# EAGLE design PiPod Rev2 (EAGLE 8.5.0)

## Sheet 1 of 4
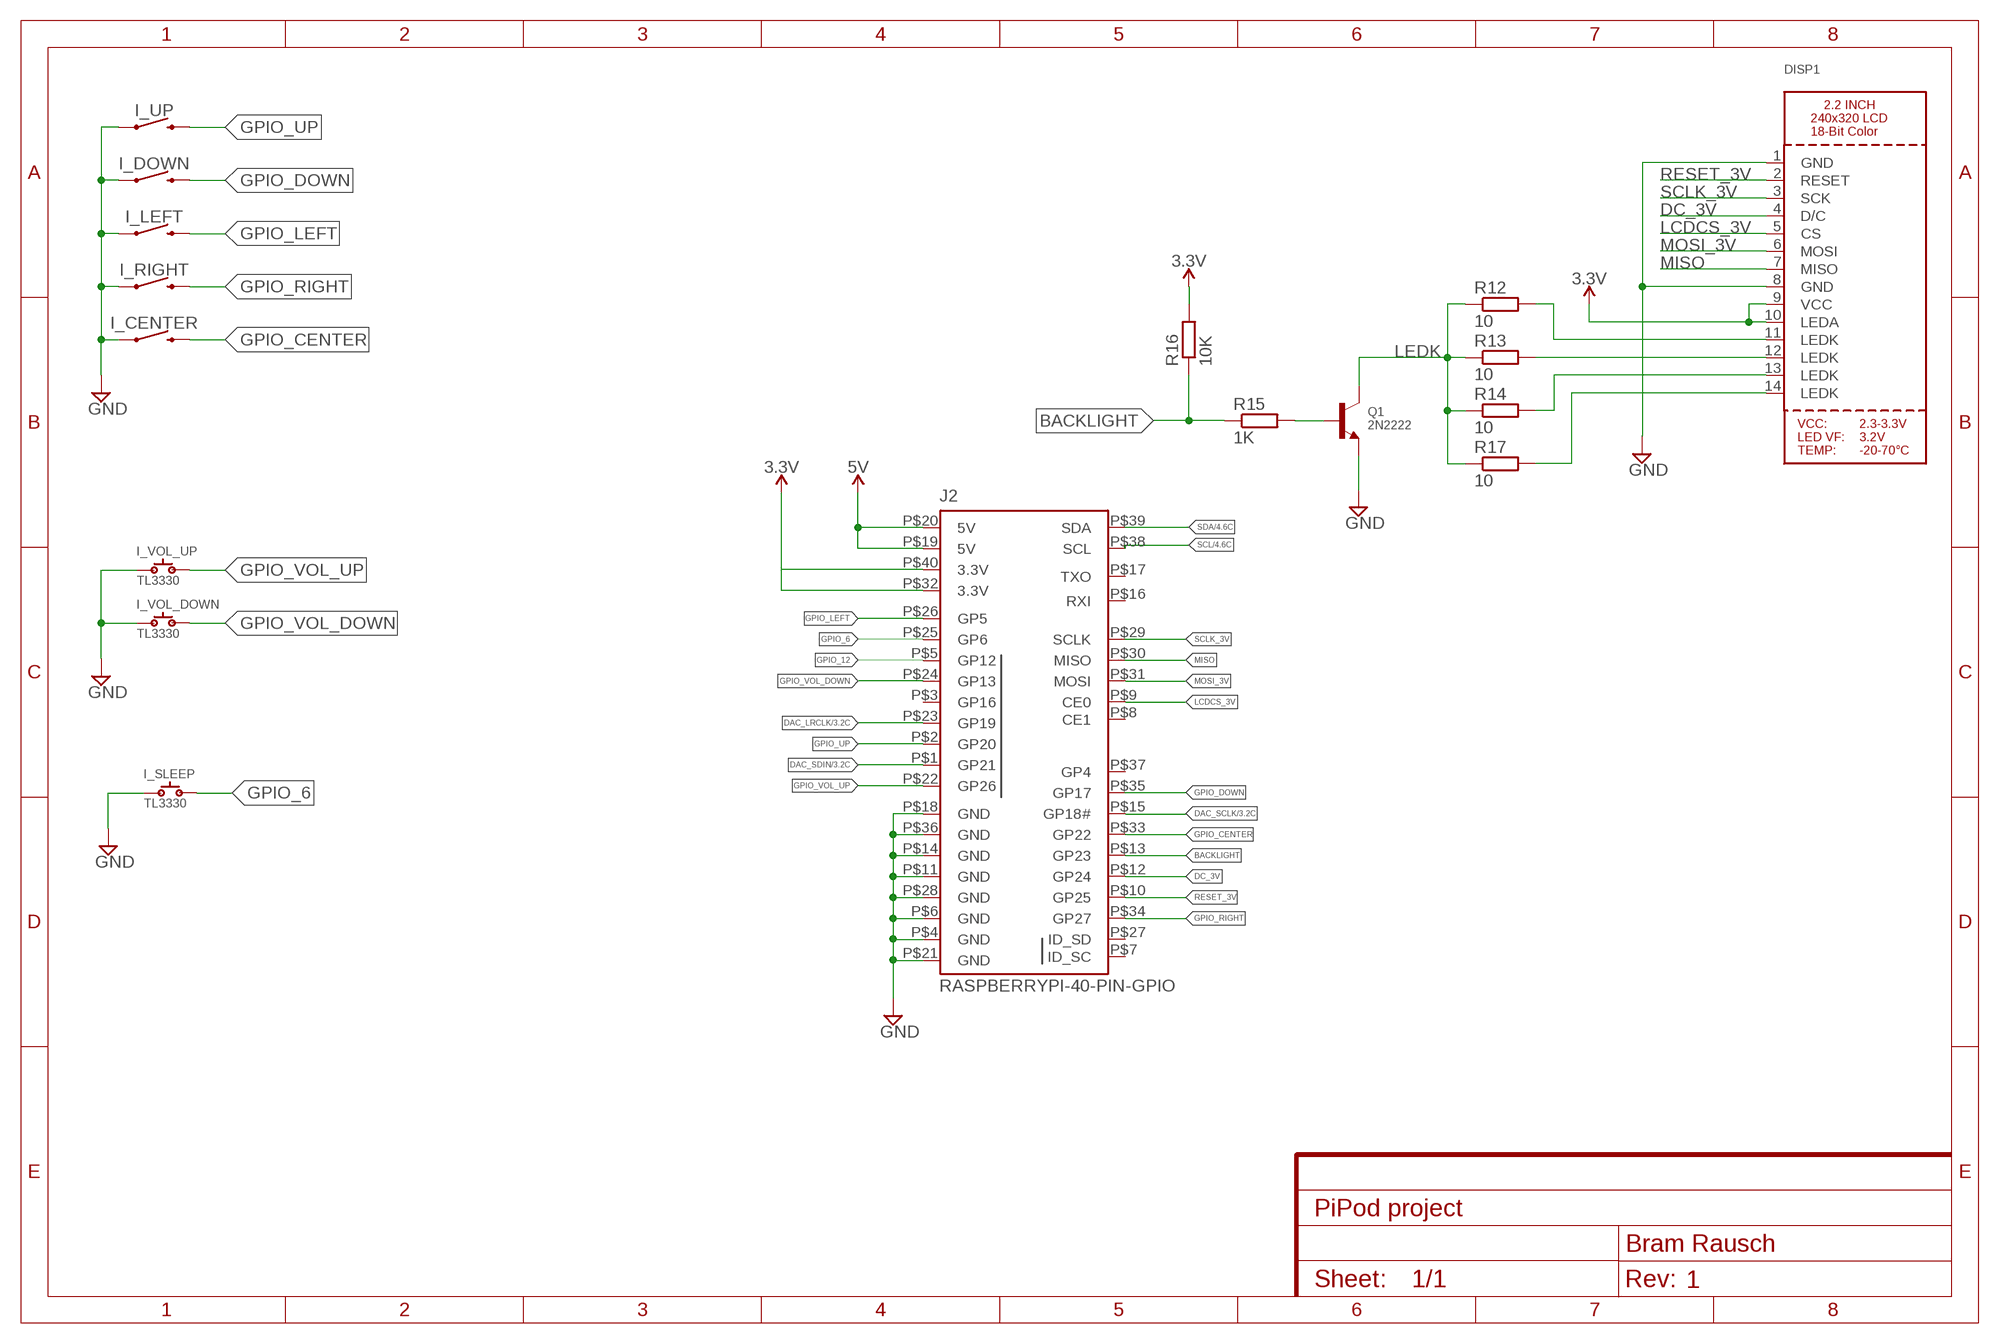
[diagram p0: schematic, sheet 1]
FRAME3 (FRAME-A4L): TITLE: PiPod - In/Out

### Parts
DISP1  DISP_LCD_TM022HDH26  [TM022HDH26_2.2IN_LCD]
I_CENTER  MOMENTARY-SWITCH-SPST-SMD-5.2-REDUNDANT  [TACTILE_SWITCH_SMD_5.2MM]
I_DOWN  MOMENTARY-SWITCH-SPST-SMD-5.2-REDUNDANT  [TACTILE_SWITCH_SMD_5.2MM]
I_LEFT  MOMENTARY-SWITCH-SPST-SMD-5.2-REDUNDANT  [TACTILE_SWITCH_SMD_5.2MM]
I_RIGHT  MOMENTARY-SWITCH-SPST-SMD-5.2-REDUNDANT  [TACTILE_SWITCH_SMD_5.2MM]
I_SLEEP  TL3330  [TL3330]
I_UP  MOMENTARY-SWITCH-SPST-SMD-5.2-REDUNDANT  [TACTILE_SWITCH_SMD_5.2MM]
I_VOL_DOWN  TL3330  [TL3330]
I_VOL_UP  TL3330  [TL3330]
J2  RASPBERRYPI-40-PIN-GPIO  [2X20_SMD]
Q1  2N2222  TRANSISTOR_NPNWIDE  [SOT23-WIDE]
R12  10  R-EU_R0805  [R0805]
R13  10  R-EU_R0805  [R0805]
R14  10  R-EU_R0805  [R0805]
R15  1K  R-EU_R0805  [R0805]
R16  10K  R-EU_R0805  [R0805]
R17  10  R-EU_R0805  [R0805]

### Nets
3.3V: DISP1.9(VCC) DISP1.10(LEDA) J2.P$32(3.3V) J2.P$40(3.3V) R16.2 ; also sheet 3
5V: J2.P$19(5V) J2.P$20(5V) ; also sheet 2
BACKLIGHT: J2.P$13(GP23) R15.1 R16.1
DAC_LRCLK: J2.P$23(GP19) ; also sheet 3
DAC_SCLK: J2.P$15(GP18#) ; also sheet 3
DAC_SDIN: J2.P$1(GP21) ; also sheet 3
DC_3V: DISP1.4(D/C) J2.P$12(GP24)
GND: DISP1.1(GND) DISP1.8(GND) I_CENTER.1 I_CENTER.2 I_DOWN.1 I_DOWN.2 I_LEFT.1 I_LEFT.2 I_RIGHT.1 I_RIGHT.2 I_SLEEP.1 I_UP.1 I_UP.2 I_VOL_DOWN.1 I_VOL_UP.1 J2.P$4(GND) J2.P$6(GND) J2.P$11(GND) J2.P$14(GND) J2.P$18(GND) J2.P$21(GND) J2.P$28(GND) J2.P$36(GND) Q1.2(E) ; also sheet 2,3,4
GPIO_6: I_SLEEP.2 J2.P$25(GP6)
GPIO_12: J2.P$5(GP12)
GPIO_CENTER: I_CENTER.3 I_CENTER.4 J2.P$33(GP22)
GPIO_DOWN: I_DOWN.3 I_DOWN.4 J2.P$35(GP17)
GPIO_LEFT: I_LEFT.3 I_LEFT.4 J2.P$26(GP5)
GPIO_RIGHT: I_RIGHT.3 I_RIGHT.4 J2.P$34(GP27)
GPIO_UP: I_UP.3 I_UP.4 J2.P$2(GP20)
GPIO_VOL_DOWN: I_VOL_DOWN.2 J2.P$24(GP13)
GPIO_VOL_UP: I_VOL_UP.2 J2.P$22(GP26)
LCDCS_3V: DISP1.5(CS) J2.P$9(CE0)
LEDK: Q1.3(C) R12.1 R13.1 R14.1 R17.1
MISO: DISP1.7(MISO) J2.P$30(MISO)
MOSI_3V: DISP1.6(MOSI) J2.P$31(MOSI)
N$21: DISP1.11(LEDK) R12.2
N$22: DISP1.12(LEDK) R13.2
N$23: DISP1.13(LEDK) R14.2
N$25: Q1.1(B) R15.2
N$26: DISP1.14(LEDK) R17.2
RESET_3V: DISP1.2(RESET) J2.P$10(GP25)
SCL: J2.P$38(SCL) ; also sheet 4
SCLK_3V: DISP1.3(SCK) J2.P$29(SCLK)
SDA: J2.P$39(SDA) ; also sheet 4
Unconnected: J2.P$3(GP16) J2.P$7(ID_SC) J2.P$8(CE1) J2.P$16(RXI) J2.P$17(TXO) J2.P$27(ID_SD) J2.P$37(GP4)

## Sheet 2 of 4
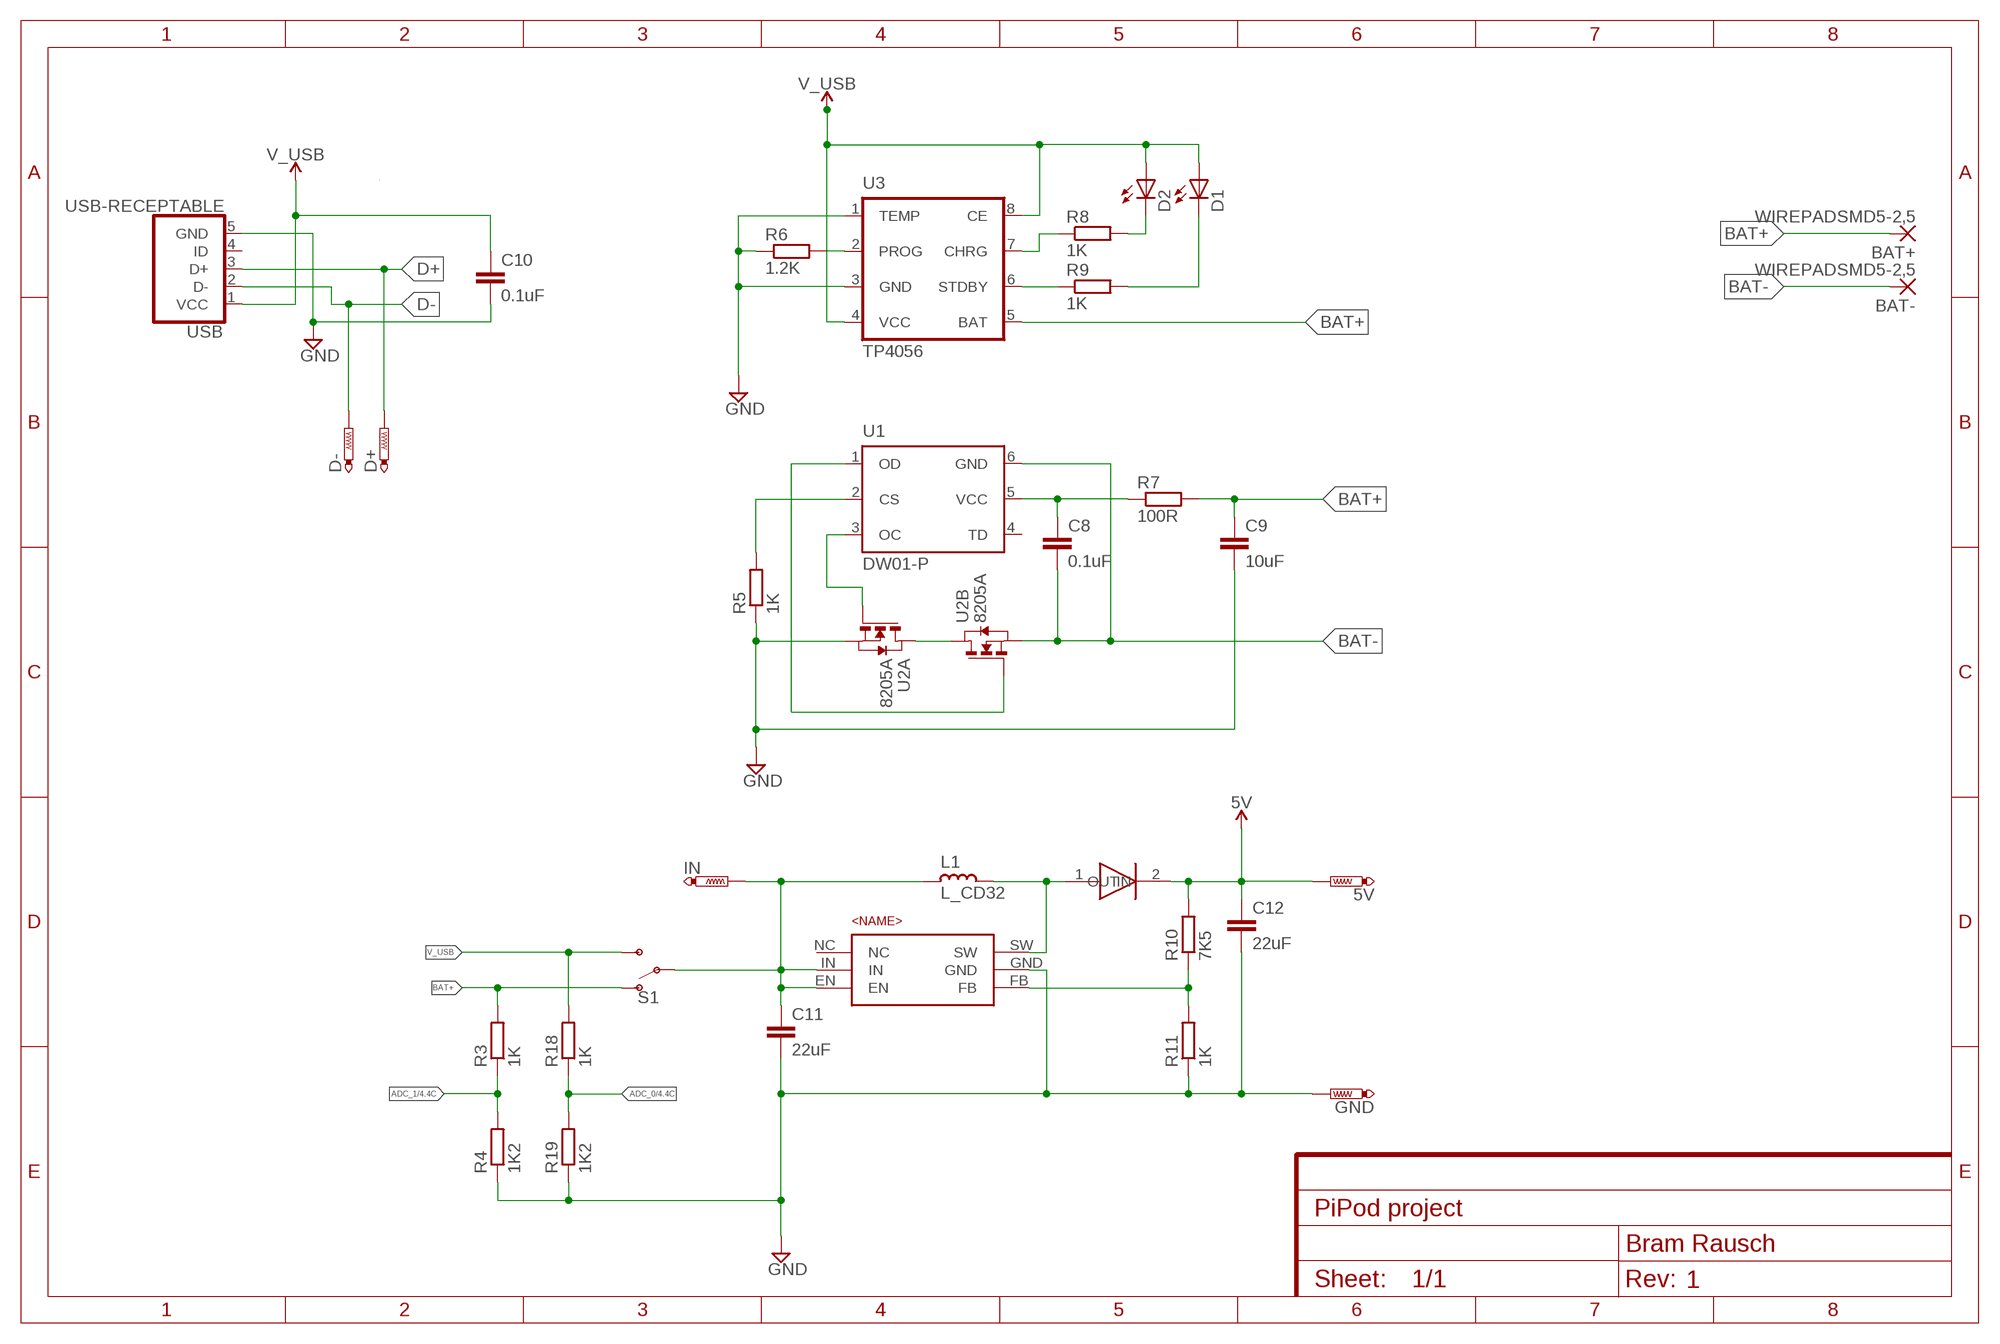
[diagram p1: schematic, sheet 2]
FRAME2 (FRAME-A4L): TITLE: PiPod - Power

### Parts
5V  PTR1B2,54  [B2,54]
BAT+  WIREPADSMD5-2,5  [5-2,5]
BAT-  WIREPADSMD5-2,5  [5-2,5]
C8  0.1uF  C-EUC1206K  [C1206K]
C9  10uF  C-EUC1206K  [C1206K]
C10  0.1uF  C-EUC1206K  [C1206K]
C11  22uF  C-EUC0805K  [C0805K]
C12  22uF  C-EUC0805K  [C0805K]
D1  LEDCHIPLED_0805  [CHIPLED_0805]
D2  LEDCHIPLED_0805  [CHIPLED_0805]
D+  PTR1TP15R  [TP15R]
D-  PTR1TP15R  [TP15R]
GND  PTR1B2,54  [B2,54]
IN  PTR1B2,54  [B2,54]
L1  L_CD32  [CD32]
R3  1K  R-EU_R0805  [R0805]
R4  1K2  R-EU_R0805  [R0805]
R5  1K  R-EU_M0805  [M0805]
R6  1.2K  R-EU_M0805  [M0805]
R7  100R  R-EU_M0805  [M0805]
R8  1K  R-EU_M0805  [M0805]
R9  1K  R-EU_M0805  [M0805]
R10  7K5  R-EU_R0805  [R0805]
R11  1K  R-EU_R0805  [R0805]
R18  1K  R-EU_R0805  [R0805]
R19  1K2  R-EU_R0805  [R0805]
S1  SWITCH-SPDT-PTH-11.6X4.0MM  [SWITCH_SPDT_PTH_11.6X4.0MM]
U1  DW01-P  [SOT23-6L]
U2  8205A  [TSSOP8]
U3  TP4056  [SO08]
U6  MT3608  [SOT23-6]
U$9  SMA-SS34  [SMA-SS34]
USB  USB-RECEPTABLE  [FCI-10103594-0001LF]

### Nets
5V: 5V.TP C12.1 R10.2 U$9.2(OUT) ; also sheet 1
ADC_0: R18.1 R19.2 ; also sheet 4
ADC_1: R3.1 R4.2 ; also sheet 4
BAT+: BAT+.1(P) C9.1 R3.2 R7.2 S1.1(O) U3.5(BAT)
BAT-: BAT-.1(P) C8.2 U1.6(GND) U2.6(B:S) U2.7(B:S)
D+: D+.TP USB.3(D+)
D-: D-.TP USB.2(D-)
GND: C9.2 C10.2 C11.2 C12.2 GND.TP R4.1 R5.1 R6.1 R11.1 R19.1 U2.2(A:S) U2.3(A:S) U3.1(TEMP) U3.3(GND) U6.GND USB.5(GND) ; also sheet 1,3,4
N$8: U2.1(A:D) U2.8(B:D)
N$11: U1.1(OD) U2.5(B:G)
N$12: R5.2 U1.2(CS)
N$13: R6.2 U3.2(PROG)
N$14: U1.3(OC) U2.4(A:G)
N$15: R9.1 U3.6(STDBY)
N$16: C8.1 R7.1 U1.5(VCC)
N$17: D2.C R8.2
N$18: D1.C R9.2
N$19: R8.1 U3.7(CHRG)
N$20: L1.1 U6.SW U$9.1(IN)
N$24: R10.1 R11.2 U6.FB
N$33: C11.1 IN.TP L1.2 S1.2(P) U6.EN U6.IN
V_USB: C10.1 D1.A D2.A R18.2 S1.3(S) U3.4(VCC) U3.8(CE) USB.1(VCC)
Unconnected: U1.4(TD) U6.NC USB.4(ID)

## Sheet 3 of 4
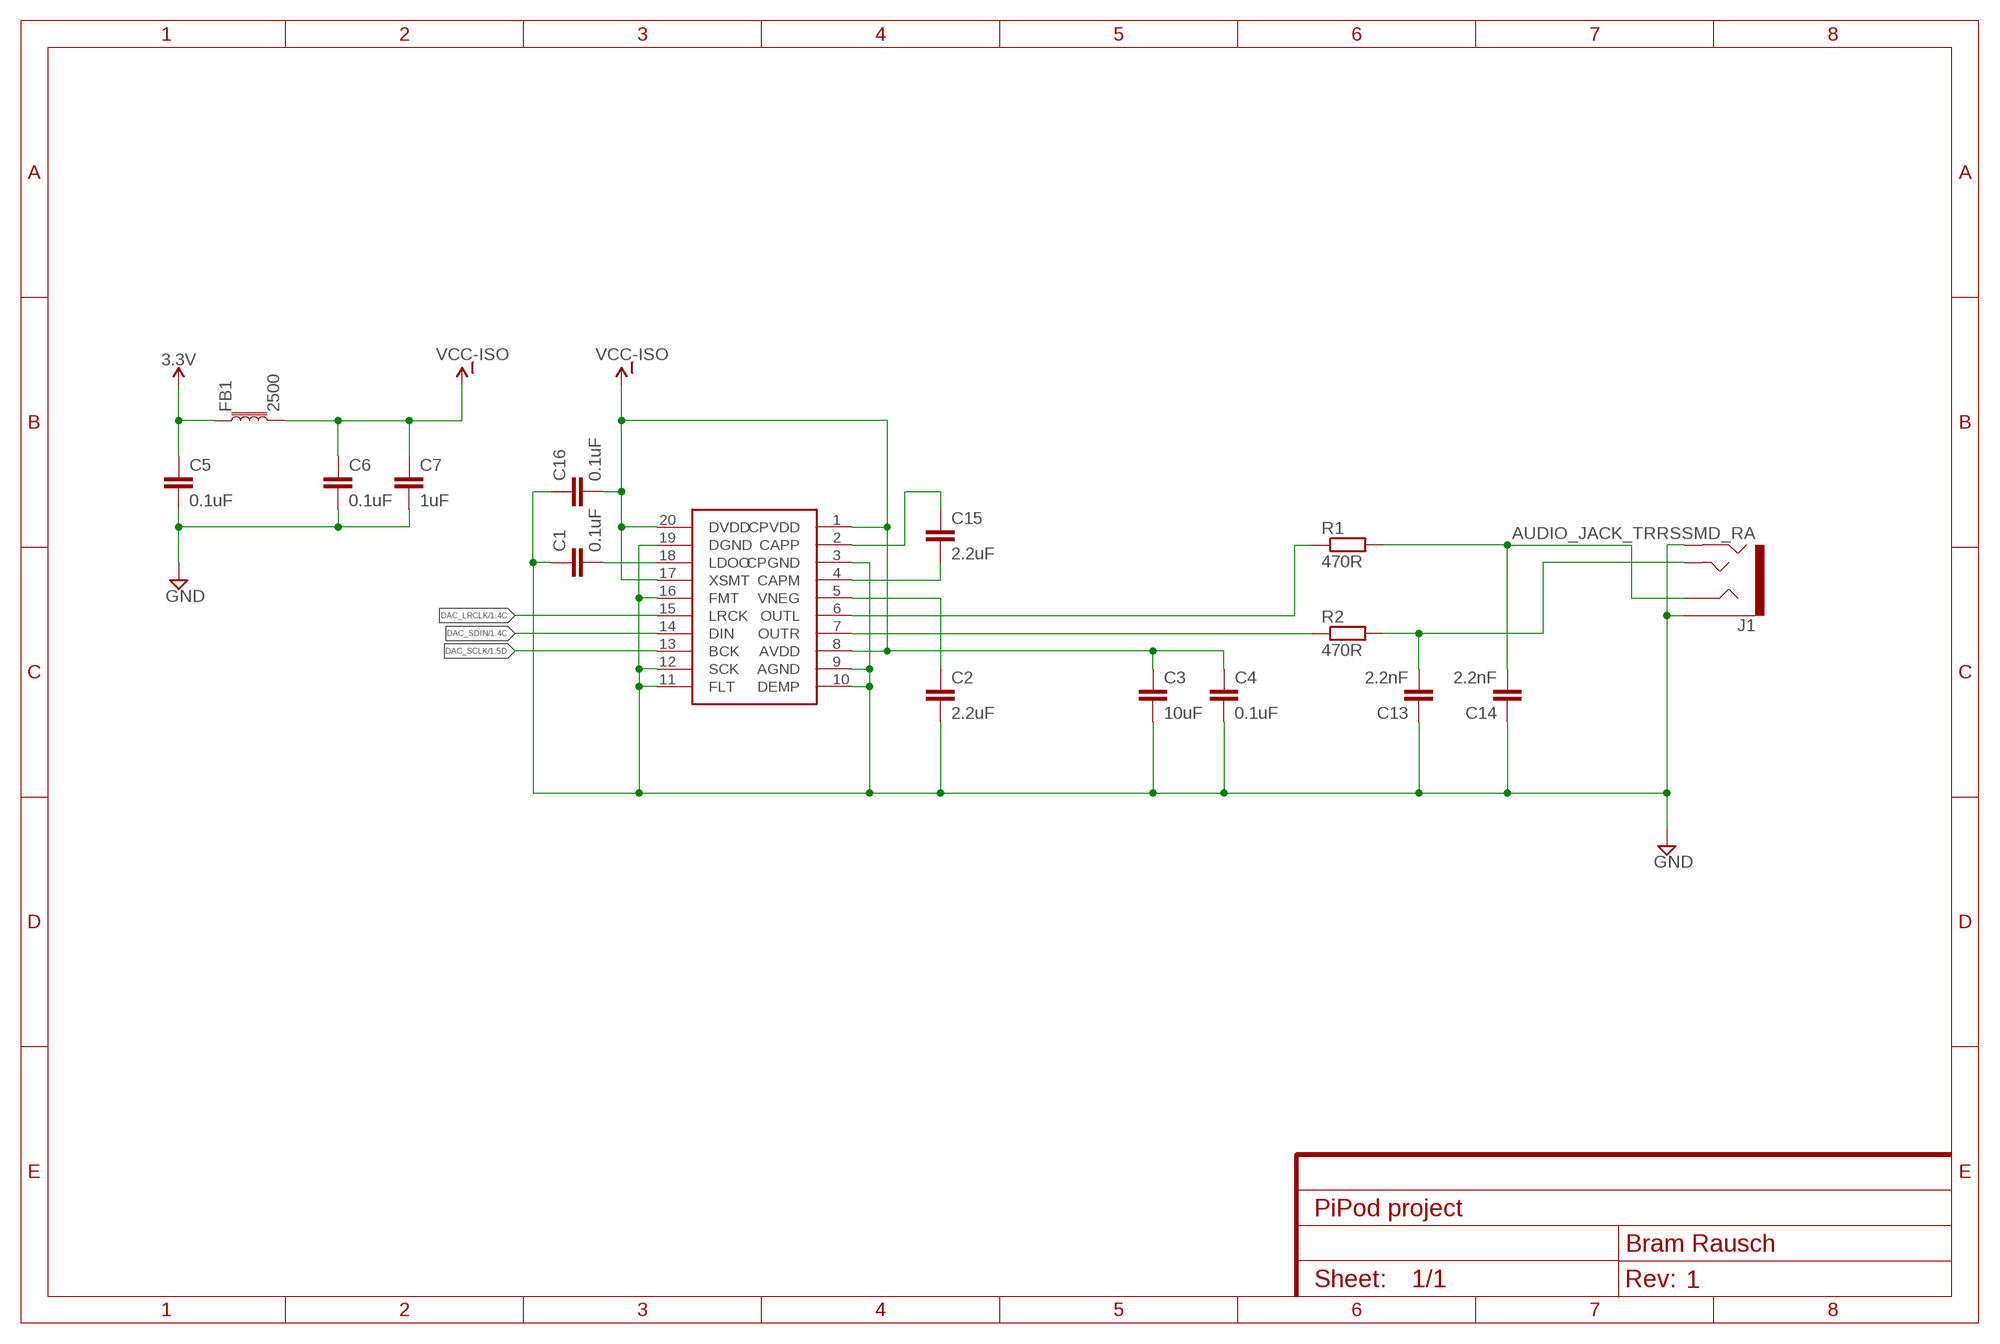
[diagram p2: schematic, sheet 3]
FRAME1 (FRAME-A4L): TITLE: PiPod - DAC

### Parts
C1  0.1uF  C-EUC0805K  [C0805K]
C2  2.2uF  C-EUC0805K  [C0805K]
C3  10uF  C-EUC0805K  [C0805K]
C4  0.1uF  C-EUC0805K  [C0805K]
C5  0.1uF  C-EUC0805K  [C0805K]
C6  0.1uF  C-EUC0805K  [C0805K]
C7  1uF  C-EUC0805K  [C0805K]
C13  2.2nF  C-EUC0805K  [C0805K]
C14  2.2nF  C-EUC0805K  [C0805K]
C15  2.2uF  C-EUC0805K  [C0805K]
C16  0.1uF  C-EUC0805K  [C0805K]
FB1  2500  FERRITE_BEAD-0603  [0603]
J1  AUDIO_JACK_TRRSSMD_RA  [AUDIO_JACK_3.5MM_TRRS_SMD_RA]
R1  470R  R-EU_R0805  [R0805]
R2  470R  R-EU_R0805  [R0805]
U5  PCM5102  [TSSOP20]

### Nets
3.3V: C5.1 FB1.1 ; also sheet 1
DAC_LRCLK: U5.15(LRCK) ; also sheet 1
DAC_SCLK: U5.13(BCK) ; also sheet 1
DAC_SDIN: U5.14(DIN) ; also sheet 1
GND: C1.1 C2.2 C3.2 C4.2 C5.2 C6.2 C7.2 C13.1 C14.1 C16.1 J1.EARTH J1.RING2 U5.3(CPGND) U5.9(AGND) U5.10(DEMP) U5.11(FLT) U5.12(SCK) U5.16(FMT) U5.19(DGND) ; also sheet 1,2,4
N$1: C1.2 U5.18(LDOO)
N$2: C2.1 U5.5(VNEG)
N$4: C15.2 U5.4(CAPM)
N$5: R2.1 U5.7(OUTR)
N$6: R1.1 U5.6(OUTL)
N$7: C15.1 U5.2(CAPP)
N$9: C13.2 J1.TIP R2.2
N$10: C14.2 J1.RING1 R1.2
VCC-ISO: C3.1 C4.1 C6.1 C7.1 C16.2 FB1.2 U5.1(CPVDD) U5.8(AVDD) U5.17(XSMT) U5.20(DVDD) ; also sheet 4

## Sheet 4 of 4
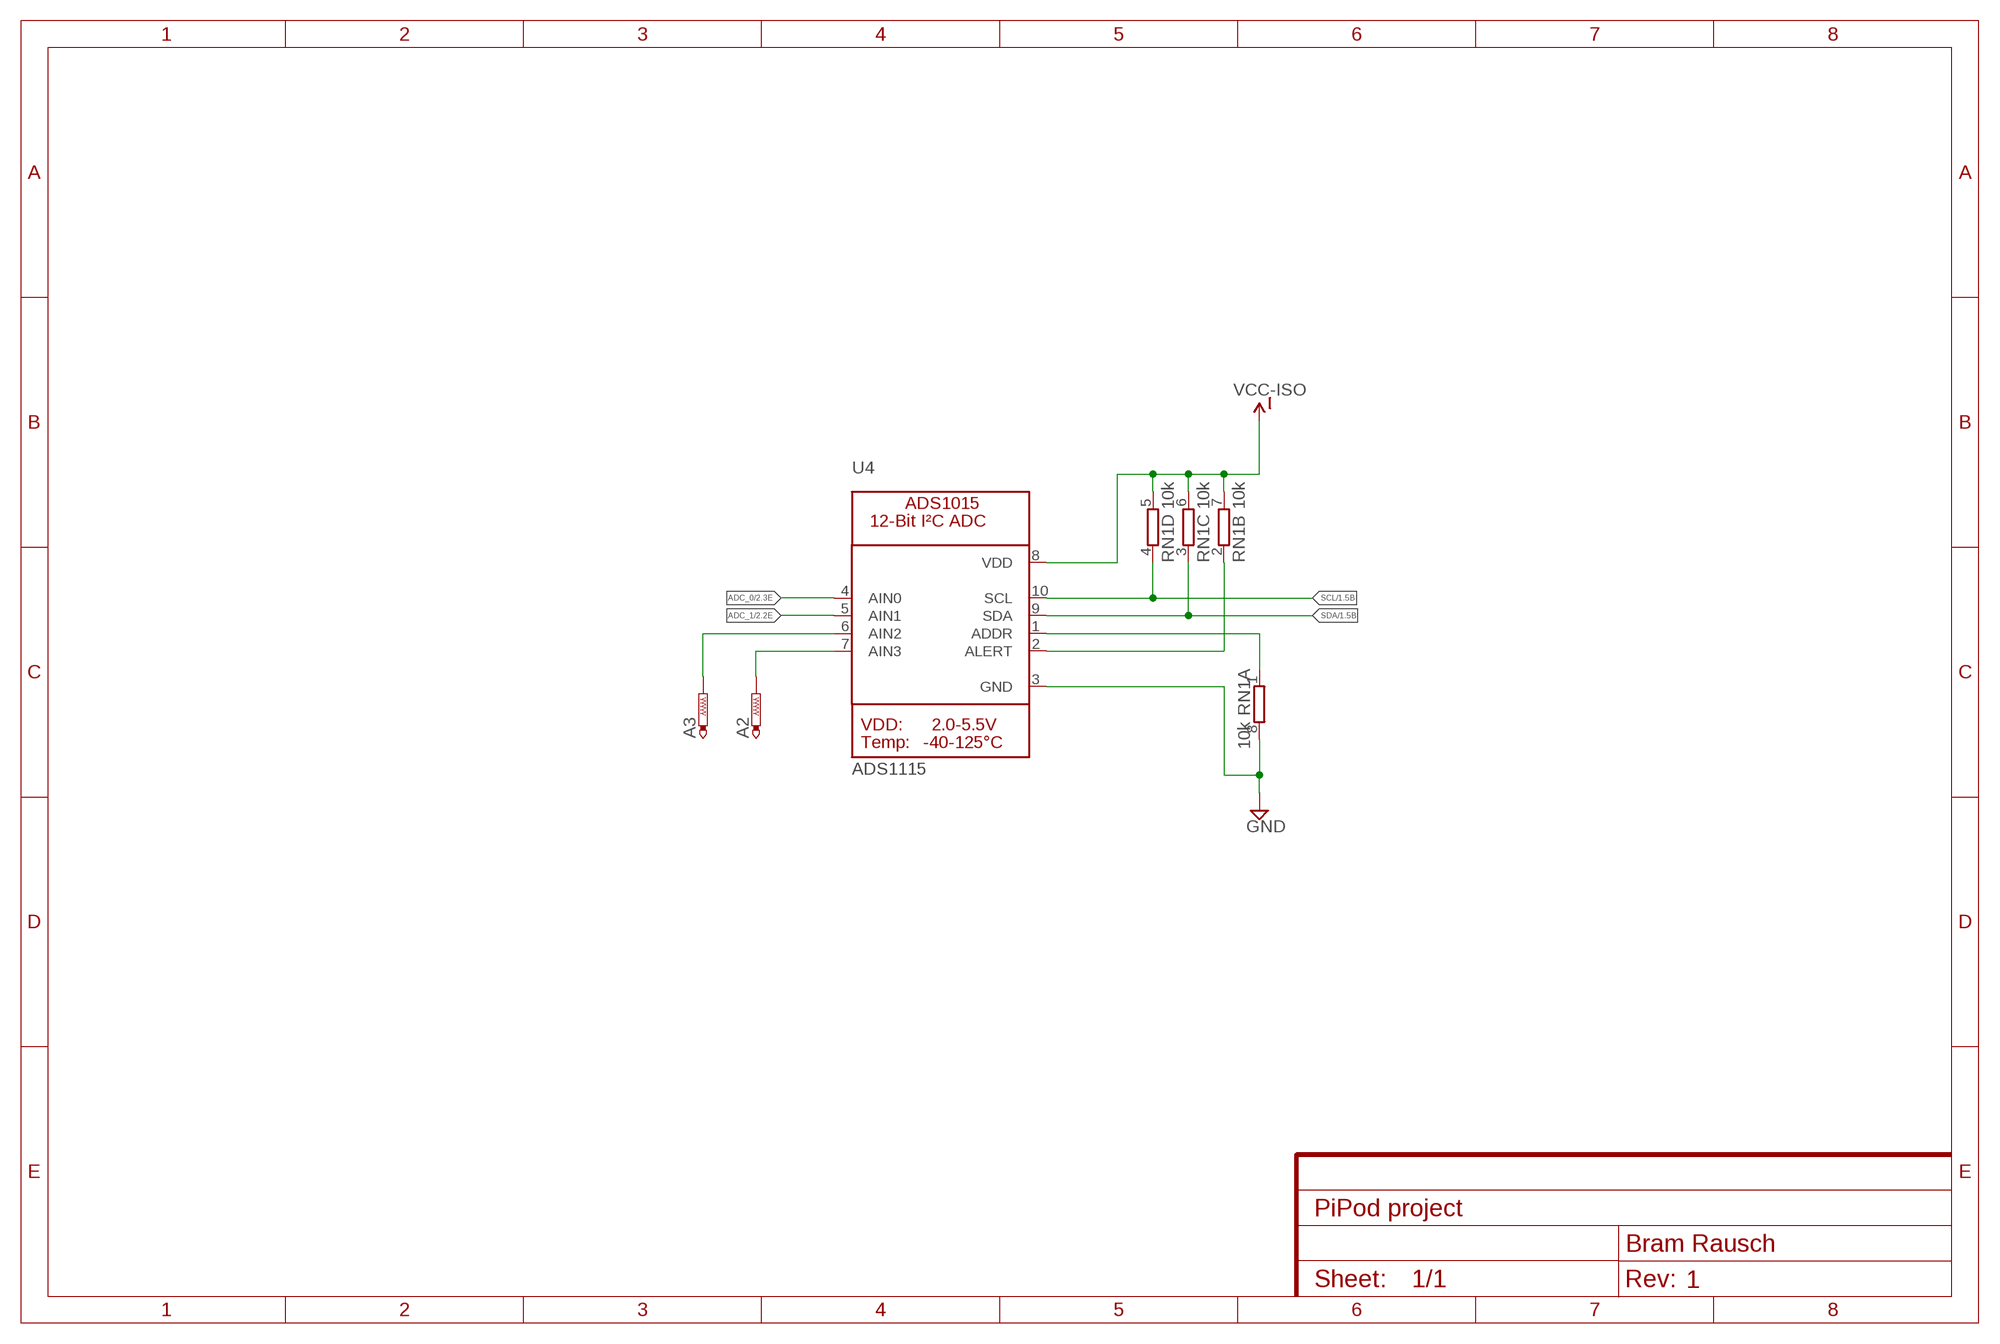
[diagram p3: schematic, sheet 4]
FRAME4 (FRAME-A4L): TITLE: PiPod - ADC

### Parts
A2  PTR1TP15R  [TP15R]
A3  PTR1TP15R  [TP15R]
RN1  10k  4R-N0603-ARC  [0603-ARC]
U4  ADS1115  MICROBUILDER_ADC_ADS1015  [MICROBUILDER_MSOP10]

### Nets
ADC_0: U4.4(AIN0) ; also sheet 2
ADC_1: U4.5(AIN1) ; also sheet 2
GND: RN1.8 U4.3(GND) ; also sheet 1,2,3
N$3: A2.TP U4.7(AIN3)
N$27: RN1.1 U4.1(ADDR)
N$31: RN1.2 U4.2(ALERT)
N$32: A3.TP U4.6(AIN2)
SCL: RN1.4 U4.10(SCL) ; also sheet 1
SDA: RN1.3 U4.9(SDA) ; also sheet 1
VCC-ISO: RN1.5 RN1.6 RN1.7 U4.8(VDD) ; also sheet 3

## Library data of the parts
5V A2 A3 D+ D- GND IN = testpad:PTR1: TEST PIN
BAT+ BAT- = wirepad:WIREPAD: Wire PAD connect wire on PCB
C1-C7 C13-C16 = rcl:C-EU: CAPACITOR, European symbol; SPICEPREFIX: C
C8-C12 = resistor:C-EU: CAPACITOR, European symbol
D1 D2 = adafruit:LED: LED OSRAM: - CHIPLED LG R971, LG N971, LY N971, LG Q971, LY Q971, LO R971, LY R971 LH N974, LH R974 LS Q976, LO Q976, LY Q976 LO Q996 - Hyper CHIPLED LW Q18S LB Q993, LB Q99A, LB R99A - SideLED LS A670, LO A670, LY A670, LG A670, LP A670 LB A673, LV A673, LT A673, LW A673 LH A674 LY A675 LS A676, LA A676, LO A676, LY A676, LW A676 LS A679, LY A679, LG A679 - Hyper Micro SIDELED® LS Y876, LA Y876, LO Y876, LY Y876 LT Y87S - SmartLED LW L88C, LW L88S LB L89C, LB L89S, LG L890 LS L89K, LO L89K, LY L89K LS L896, LA L896, LO L896, LY L896 - TOPLED LS T670, LO T670, LY T670, LG T670, LP T670 LSG T670, LSP T670, LSY T670, LOP T670, LYG T670 LG T671, LOG T671, LSG T671 LB T673, LV T673, LT T673, LW T673 LH T674 LS T676, LA T676, LO T676, LY T676, LB T676, LH T676, LSB T676, LW T676 LB T67C, LV T67C, LT T67C, LS T67K, LO T67K, LY T67K, LW E67C LS E67B, LA E67B, LO E67B, LY E67B, LB E67C, LV E67C, LT E67C LW T67C LS T679, LY T679, LG T679 LS T770, LO T770, LY T770, LG T770, LP T770 LB T773, LV T773, LT T773, LW T773 LH T774 LS E675, LA E675, LY E675, LS T675 LS T776, LA T776, LO T776, LY T776, LB T776 LHGB T686 LT T68C, LB T68C - Hyper Mini TOPLED® LB M676 - Mini TOPLED Santana® LG M470 LS M47K, LO M47K, LY M47K Source: http://www.osram.convergy.de/
DISP1 = microbuilder:DISP_LCD_TM022HDH26: TM022HDH26 2.2 Inch 240x320 18-bit LCD - ILI9340C Controller
FB1 = SparkFun-Coils:FERRITE_BEAD: Ferrite Bead (blocks, cores, rings, chokes, etc.) Inductor with layers of ferrite used to suppress high frequencies. Often used to isolate high frequency noise. SparkFun Products: IOIO-OTG - V2.2 <https://www.sparkfun.com/products/13613> SparkFun SAMD21 Mini Breakout <https://www.sparkfun.com/products/13664> SparkFun 6 Degrees of Freedom Breakout - LSM6DS3 <https://www.sparkfun.com/products/13339> SparkFun SAMD21 Dev Breakout <https://www.sparkfun.com/products/13672>; PROD_ID: NDUC-07859; VALUE: 30Ω/1.8A
I_CENTER I_DOWN I_LEFT I_RIGHT I_UP = SparkFun-Switches:MOMENTARY-SWITCH-SPST: Momentary Switch (Pushbutton) - SPST Normally-open (NO) SPST momentary switches (buttons, pushbuttons). Variants PTH-12MM - 12mm square, through-hole Momentary Pushbutton Switch - 12mm Square <https://www.sparkfun.com/products/9190> (COM-09190) PTH-6.0MM, PTH-6.0MM-KIT - 6.0mm square, through-hole Mini Pushbutton Switch <https://www.sparkfun.com/products/97> (COM-00097) KIT package intended for soldering kit's - only one side of pads' copper is exposed. PTH-RIGHT-ANGLE-KIT - Right-angle, through-hole Right Angle Tactile Button <https://www.sparkfun.com/products/10791> - Used on SparkFun BigTime Watch Kit <https://www.sparkfun.com/products/11734> SMD-12MM - 12mm square, surface-mount Tactile Button - SMD (12mm) <https://www.sparkfun.com/products/12993> (COM-12993) Used on SparkFun PicoBoard <https://www.sparkfun.com/products/11888> SMD-4.5MM - 4.5mm Square Trackball Switch Used on SparkFun Blackberry Trackballer Breakout <https://www.sparkfun.com/products/13169> SMD-4.6MMX2.8MM - 4.60mm x 2.80mm, surface mount Used on SparkFun SAMD21 Mini Breakout <https://www.sparkfun.com/products/13664> SMD-5.2MM, SMD-5.2-REDUNDANT - 5.2mm square, surface-mount Mini Pushbutton Switch - SMD <https://www.sparkfun.com/products/8720> (COM-08720) Used on Arduino Pro Mini <https://www.sparkfun.com/products/11114> REDUNDANT package connects both switch circuits together SMD-6.0X3.5MM - 6.0 x 3.5mm, surface mount Momentary Reset Switch SMD <https://www.sparkfun.com/products/8229> (COM-08229) SMD-6.2MM-TALL - 6.2mm square, surface mount Tactile Button - SMD (6mm) <https://www.sparkfun.com/products/12992> Used on SparkFun Digital Sandbox <https://www.sparkfun.com/products/12651> SMD-RIGHT-ANGLE - Right-angle, surface mount Used on SparkFun Block for Intel® Edison - Arduino <https://www.sparkfun.com/products/13036>; PROD_ID: SWCH-08247; SF_SKU: COM-08720
I_SLEEP I_VOL_DOWN I_VOL_UP = e-switch:TL3330
J1 = SparkFun-Connectors:AUDIO_JACK_TRRS: Audio Jack - 3.5mm TRRS (SMD) This is a 3.5mm TRRS SMD audio jack. TRRS connectors are the audio-style connectors that you see on some phones, MP3 players and development boards. TRRS stands for “tip, ring, ring, sleeve,” which reflects that this has three conductors and a ground. SparkFun Products: Audio Jack <https://www.sparkfun.com/products/12639> mbed Starter Kit <https://www.sparkfun.com/products/12968> SparkFun TRRS 3.5mm Jack Breakout <https://www.sparkfun.com/products/11570>; PROD_ID: CONN-10676; SF_ID: PRT-12639
J2 = SparkFun-Connectors:RASPBERRYPI-40-PIN-GPIO: Raspberry Pi GPIO Header 2x20 pin connector, as found on B, B+, A+ models. Both shrouded PTH and SMT versions available. SparkFun Products: GPIO Shrouded Header <https://www.sparkfun.com/products/13054>- PTH SparkFun Pi Wedge (Preassembled) <https://www.sparkfun.com/products/13717>
L1 = rc-master-smd:L_: INDUCTOR
Q1 = microbuilder:TRANSISTOR_NPN: NPN Transistor Transistor (NPN) 500mA 45V - BC817 [Digikey: 568-1631-1-ND] Transistor (NPN) 500mA 45V - BC817,215 [Mouser: 771-BC817-T/R] SOT23-R - SOT23 footprint optimised for use with solder paste and reflow ovens. SOT23-W - SOT23 footprint optimised for hand-soldering (larger pads).
R1-R19 = resistor:R-EU_: RESISTOR, European symbol
RN1 = resistor-dil:4R-N: Array Chip Resistor Source: RS Component / Phycomp; OC_FARNELL: unknown; OC_NEWARK: unknown
S1 = SparkFun-Switches:SWITCH-SPDT: Single Pole, Double Throw (SPDT) Switch Single-pole, double-throw (SPDT) switch. Variant Overview SMD-AYZ0202 Surface Mount DPDT Switch <https://www.sparkfun.com/products/597> (COM-00597) Used on e.g. LilyPad Arduino USB - ATmega32U4 Board <https://www.sparkfun.com/products/12049> PTH-11.6X4.0MM SPDT Mini Power Switch <https://www.sparkfun.com/products/102> (COM-00102) Used on e.g. SparkFun Simon Says - Through-Hole Soldering Kit <https://www.sparkfun.com/products/10547> (KIT-10547) PTH-11.6X4.0MM-KIT KIT version of SPDT Mini Power Switch - Simplifies soldering by removing tStop of switch pins - only one side can be soldered. PTH-11.6X4.0MM-LOCK LOCK version of SPDT Mini Power Switch - Offset pins hold switch in place for easier soldering. SMD-RIGHT-ANGLE Surface Mount Right Angle Switch <https://www.sparkfun.com/products/10860> (COM-10860) Used on e.g. SparkFun ESP8266 Thing <https://www.sparkfun.com/products/13231>; PROD_ID: SWCH-08261; SF_SKU: COM-00102
U1 = lipo:DW01-P: One Cell Lithium-ion/Polymer Battery Protection IC The DW01-P battery protection IC is designed to protect lithium-ion/polymer battery from damage or degrading the lifetime due to overcharge, overdischarge, and/or overcurrent for one-cell lithium-ion/polymer battery powered systems, such as cellular phones. The ultra-small package and less required external components make it ideal to integrate the DW01-P into the limited space of battery pack. The accurate ±50mV overcharging detection voltage ensures safe and full utilization charging. The very low standby current drains little current from the cell while in storage.
U2 = lipo:8205A: DUAL N-CHANNEL MOSFET The 8205A uses advanced trench technology to provide excellent RDS(ON), low gate charge and operation with gate voltages as low as 2.5V. This device is suitable for use as a Battery protection or in other Switching application.
U3 = lipo:TP4056: 1A Standalone Linear Li-lon Battery Charger with Thermal Regulation The TP4056 is a complete constant-current/constant-voltage linear charger for single cell lithium-ion batteries. Its SOP package and low external component count make the TP4056 ideally suited for portable applications. Further more, the TP4056 can work within USB and wall adapter.
U4 = Adafruit_ADS1015_12Bit_I2C_ADC:MICROBUILDER_ADC_ADS1015: ADS1015 - 12-bit 4-Channel I2C ADC with Internal PGA VDD: 2.0-5.5V Sampling Rate: 3.3ksps Gain Settings: 2/3, 1, 2, 4, 8, 16 I2C Address: ADDR low = 1001000x, ADDR high = 1001001x Internal Comparator The ADS1015 includes an internal comparator that can be set to output a high-level on ALERT when the conversion results exceeeds a pre-defined upper level, and will deassert itself when the level falls below a pre-defined lower threshold level. It can also be set to windowed mode where the ALERT pin will be asserted if the data exceeds the upper threshold or falls below the lower threshold.
U5 = PCM5102:PCM5102
U6 = MT3608:MT3608
U$9 = SMA-SS34:SMA-SS34
USB = daspilker:USB-RECEPTABLE: USB Receptable

## Board
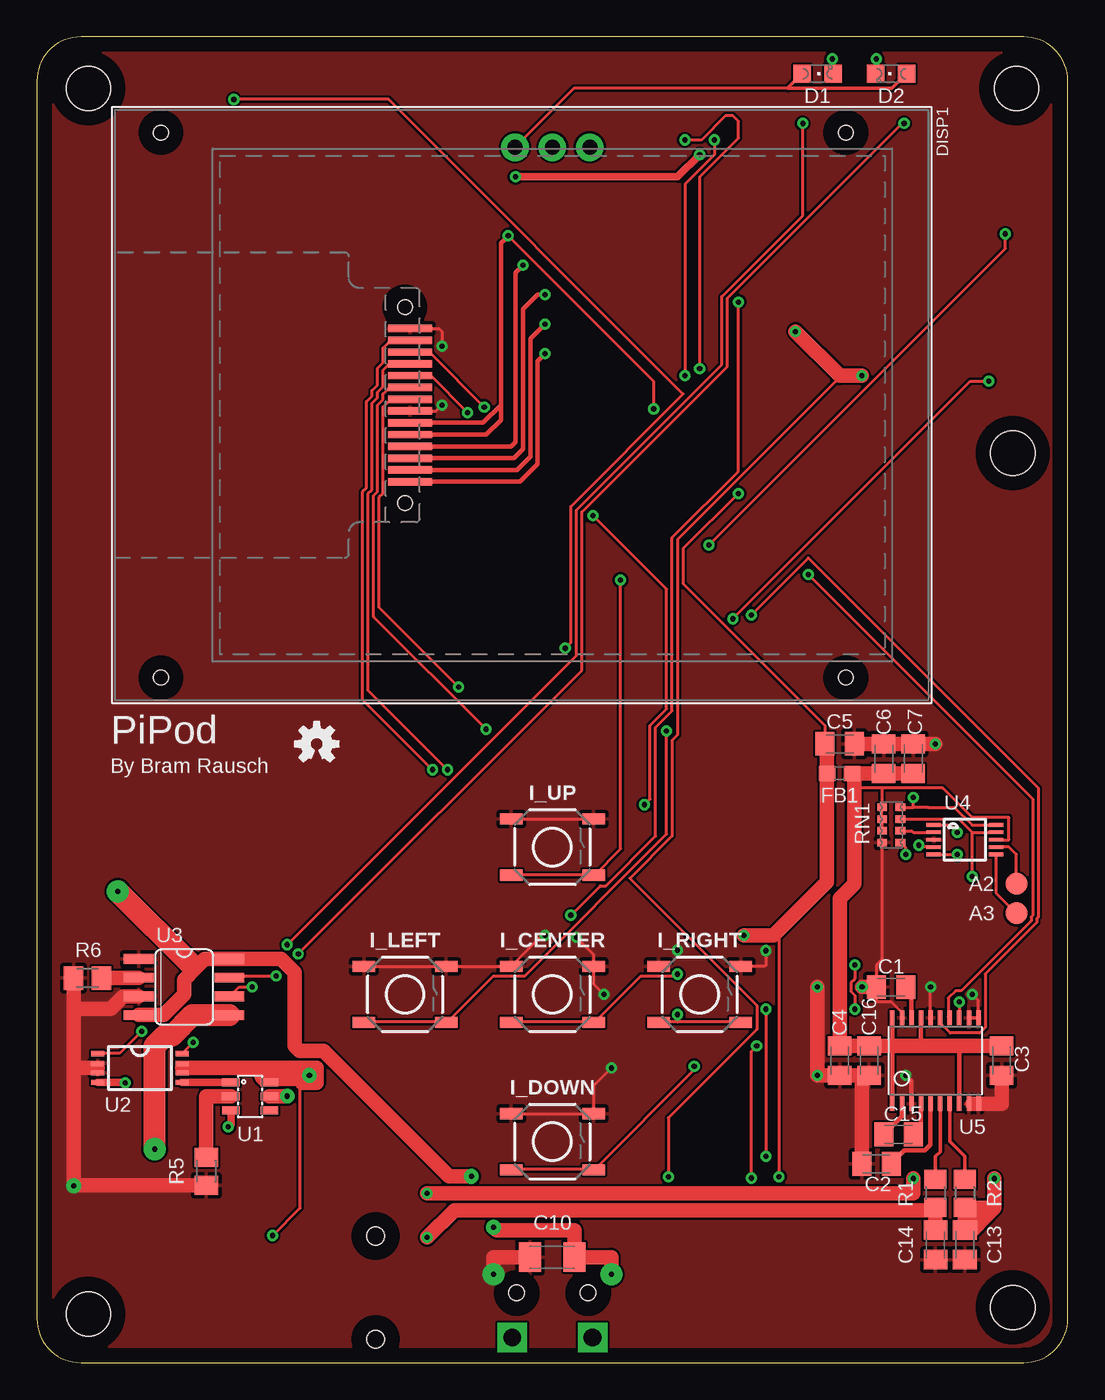
[diagram p4: board, top side]
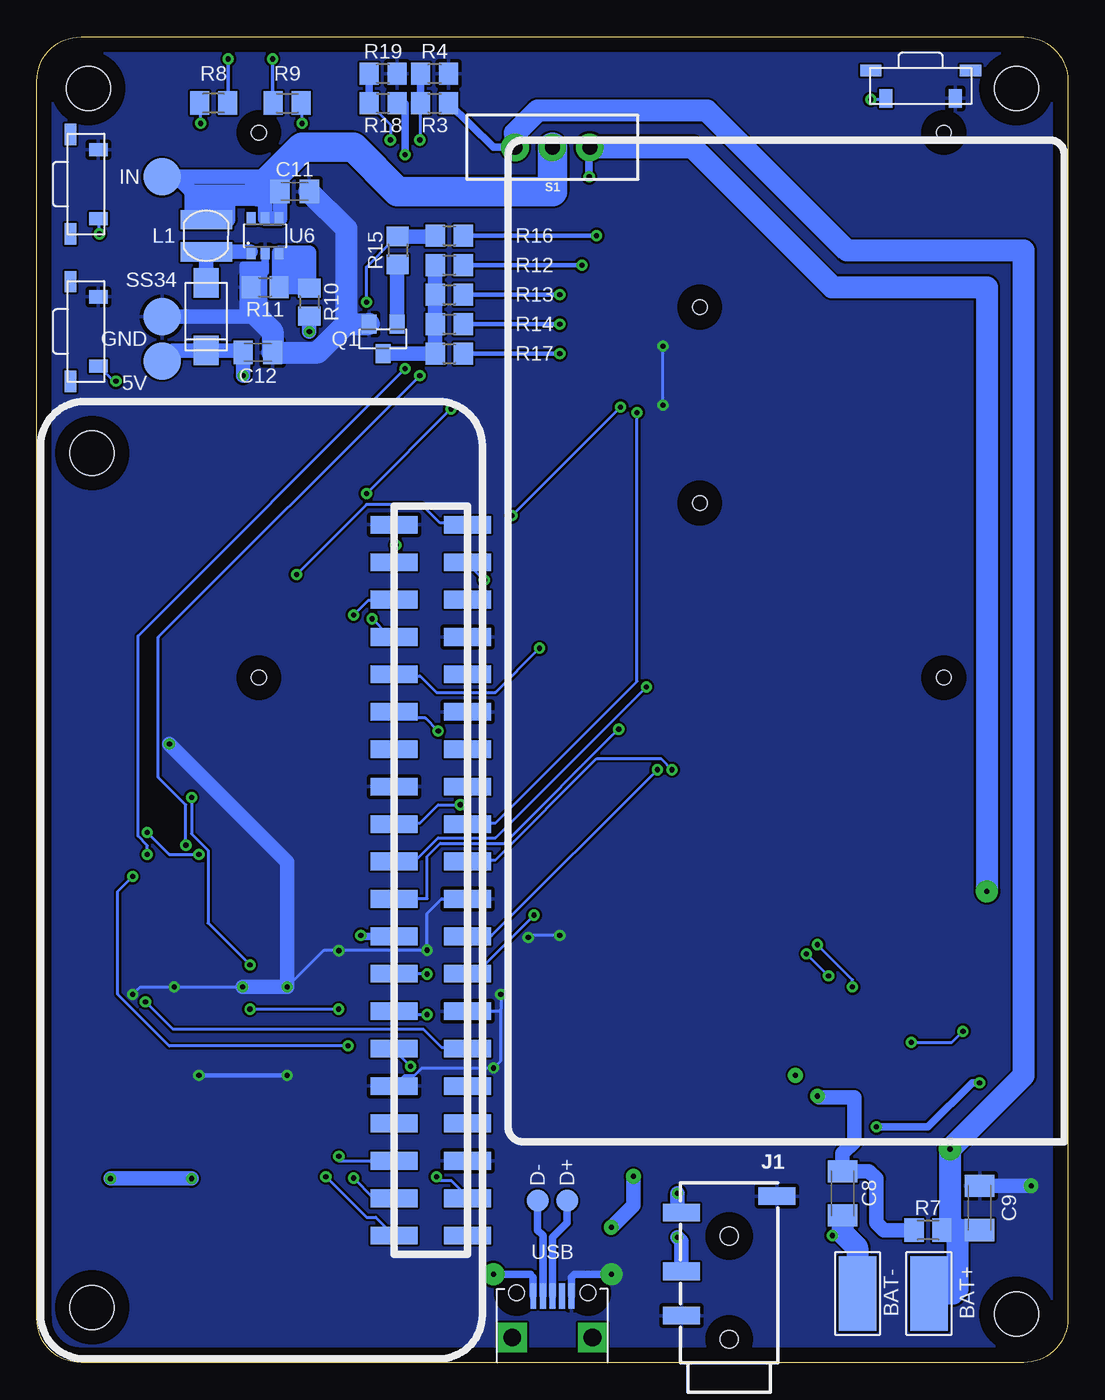
[diagram p5: board, bottom side, seen from below]

Size 70 x 90 mm. Coordinates in mm from the lower left corner, seen from the top.
Outline: 70,3 70,87 arc90 67,90 3,90 arc90 0,87 0,3 arc90 3,0 67,0 arc90 70,3
Copper layers (1*16): Top 0.035mm / dielectric 1.5mm / Bottom 0.035mm
Design rules "default *": minimum track width 0.2mm, minimum drill 0.35mm, track to track 6mil, track to pad 6mil, pad to pad 6mil, via to via 6mil, smd to smd 6mil, copper to edge 40mil, drill to drill 6mil, minimum pad ring 10mil, minimum via ring 8mil, stop-mask expansion 4mil, vias tented up to drill 0mil, thermal gap 10mil
Holes 3 mm at 3.5,3.3 3.5,86.5 66.5,86.5

### Footprints (pad centres in the part's own frame; a part is rotated, then mirrored left to right if it is on the bottom)
B2,54 = smd 2.54 x 2.54: TP 0,0
TP15R = smd 1.5 x 1.5: TP 0,0
5-2,5 = smd 2.54 x 5.08: 1 0,0
C0805K = smd 1.3 x 1.6: 1 -1,0; 2 1,0
C1206K = smd 1.5 x 2: 1 -1.5,0; 2 1.5,0
CHIPLED_0805 = smd 1.2 x 1.2: A 0,-1.05; C 0,1.05
TM022HDH26_2.2IN_LCD = smd 0.5 x 3: 1 -5.2,-9.66; 2 -4.4,-9.66; 3 -3.6,-9.66; 4 -2.8,-9.66; 5 -2,-9.66; 6 -1.2,-9.66; 7 -0.4,-9.66; 8 0.4,-9.66; 9 1.2,-9.66; 10 2,-9.66; 11 2.8,-9.66; 12 3.6,-9.66; 13 4.4,-9.66; 14 5.2,-9.66 | hole 1: -6.65,-10.01; 6.65,-10.01; 18.5,19.92; -18.5,19.92; -18.5,-26.58; 18.5,-26.58
0603 = smd 1.1 x 1: 1 -0.85,0; 2 0.85,0
TACTILE_SWITCH_SMD_5.2MM = smd 1.524 x 0.762: 1 -2.794,1.905; 2 2.794,1.905; 3 -2.794,-1.905; 4 2.794,-1.905
TL3330 = smd 0.889 x 1.27: 1 -2.349,2.032; 2 2.349,2.032 | smd 1.448 x 0.787: NC -3.378,0.14; NC@1 3.378,0.14
AUDIO_JACK_3.5MM_TRRS_SMD_RA = smd 1.2 x 2.5: EARTH 11.3,-3.25; RING1 6.2,3.25; RING2 3.2,3.25; TIP 10.2,3.25 | hole 1.2: 1.6,0; 8.6,0
2X20_SMD = smd 3.2 x 1.2: P$1 1,8.37; P$2 1,10.91; P$3 1,13.45; P$4 1,15.99; P$5 1,18.53; P$6 1,21.07; P$7 1,23.61; P$8 1,26.15; P$9 1,28.69; P$10 1,31.23; P$11 1,33.77; P$12 1,36.31; P$13 1,38.85; P$14 1,41.39; P$15 1,43.93; P$16 1,46.47; P$17 1,49.01; P$18 1,51.55; P$19 1,54.09; P$20 1,56.63; P$21 6,8.37; P$22 6,10.91; P$23 6,13.45; P$24 6,15.99; P$25 6,18.53; P$26 6,21.07; P$27 6,23.61; P$28 6,26.15; P$29 6,28.69; P$30 6,31.23; P$31 6,33.77; P$32 6,36.31; P$33 6,38.85; P$34 6,41.39; P$35 6,43.93; P$36 6,46.47; P$37 6,49.01; P$38 6,51.55; P$39 6,54.09; P$40 6,56.63 | hole 3: 26.5,3.5; 26.5,61.5
CD32 = smd 3.5 x 1.3: 1 0,1.1; 2 0,-1.1
SOT23-WIDE = smd 1 x 1.27: 1 -0.95,-1; 2 0.95,-1; 3 0,1
R0805 = smd 1.3 x 1.5: 1 -0.95,0; 2 0.95,0
M0805 = smd 1.3 x 1.6: 1 -0.95,0; 2 0.95,0
0603-ARC = smd 0.5 x 0.65: 1 -1.2,-0.625; 2 -0.4,-0.625; 3 0.4,-0.625; 4 1.2,-0.625; 5 1.2,0.625; 6 0.4,0.625; 7 -0.4,0.625; 8 -1.2,0.625
SWITCH_SPDT_PTH_11.6X4.0MM = drill 1.016 pad 1.88: 1 0,2.54; 2 0,0; 3 0,-2.54
SOT23-6L = smd 0.55 x 1.2: 1 -0.95,-1.3; 2 0,-1.3; 3 0.95,-1.3; 4 0.95,1.3; 5 0,1.3; 6 -0.95,1.3
TSSOP8 = smd 0.9 x 0.35: 1 -2.875,0.975; 2 -2.875,0.325; 3 -2.875,-0.325; 4 -2.875,-0.975; 5 2.875,-0.975; 6 2.875,-0.325; 7 2.875,0.325; 8 2.875,0.975
SO08 = smd 0.66 x 2.032: 1 -1.905,-3.073; 2 -0.635,-3.073; 3 0.635,-3.073; 4 1.905,-3.073; 5 1.905,3.073; 6 0.635,3.073; 7 -0.635,3.073; 8 -1.905,3.073
MICROBUILDER_MSOP10 = smd 0.25 x 1: 1 -1,-2.113; 2 -0.5,-2.113; 3 0,-2.113; 4 0.5,-2.113; 5 1,-2.113; 6 1,2.113; 7 0.5,2.113; 8 0,2.113; 9 -0.5,2.113; 10 -1,2.113
TSSOP20 = smd 0.305 x 0.991: 1 -2.925,-2.918; 2 -2.275,-2.918; 3 -1.625,-2.918; 4 -0.975,-2.918; 5 -0.325,-2.918; 6 0.325,-2.918; 7 0.975,-2.918; 8 1.625,-2.918; 9 2.275,-2.918; 10 2.925,-2.918; 11 2.925,2.918; 12 2.275,2.918; 13 1.625,2.918; 14 0.975,2.918; 15 0.325,2.918; 16 -0.325,2.918; 17 -0.975,2.918; 18 -1.625,2.918; 19 -2.275,2.918; 20 -2.925,2.918
SOT23-6 = smd 0.6 x 0.9: EN 0.95,1.15; FB 0.95,-1.15; GND 0,-1.15; IN 0,1.15; NC -0.95,1.15; SW -0.95,-1.15
SMA-SS34 = smd 2 x 1.7: 1 -2.31,-0.01; 2 2.29,-0.01
FCI-10103594-0001LF = smd 0.4 x 1.75: 1 -1.3,4.525; 2 -0.65,4.525; 3 0,4.525; 4 0.65,4.525; 5 1.3,4.525 | drill 1.2 pad 2 square: P$3 -2.725,1.7; P$4 2.725,1.7 | hole 1.05: -2.425,4.73; 2.425,4.73

### Placement (x,y rotation side)
5V  61.5,68 0 bottom
A2  66.5,32.5 0 top
A3  66.5,30.5 0 top
BAT+  9.43,4.69 180 bottom
BAT-  14.28,4.69 180 bottom
C1  58,25.5 0 top
C2  57,13.5 180 top
C3  65.5,20.5 270 top
C4  54.5,20.5 270 top
C5  54.5,42 0 top
C6  57.5,41 90 top
C7  59.5,41 90 top
C8  15.3,11.5 270 bottom
C9  6,10.5 90 bottom
C10  34.99,7.16 180 top
C11  52.5,79.5 0 bottom
C12  55,68.57 0 bottom
C13  63,8 90 top
C14  61,8 90 top
C15  58.5,15.5 0 top
C16  56.5,20.5 90 top
D1  53,87.5 270 top
D2  58,87.5 90 top
D+  34,11 0 bottom
D-  36,11 0 bottom
DISP1  35,65 270 top
E$1  [OSHW-LOGO-S]  19,42 0 top
FB1  54.5,40 0 top
GND  61.5,71 0 bottom
I_CENTER  35,25 0 top
I_DOWN  35,15 0 top
I_LEFT  25,25 0 top
I_RIGHT  45,25 0 top
I_SLEEP  10,87.85 180 bottom
I_UP  35,35 0 top
I_VOL_DOWN  67.85,70 270 bottom
I_VOL_UP  67.85,80 270 bottom
IN  61.5,80.5 0 bottom
J1  23,0 90 bottom
J2  39.75,65.25 180 bottom
L1  58.5,76.5 180 bottom
Q1  46.5,69.5 180 bottom
R1  61,11.5 270 top
R2  63,11.5 270 top
R3  43,85.5 0 bottom
R4  43,87.5 180 bottom
R5  11.5,13 90 top
R6  3.44,26.11 0 top
R7  9.5,9 0 bottom
R8  58,85.5 0 bottom
R9  53,85.5 180 bottom
R10  51.5,72 270 bottom
R11  54.5,73 0 bottom
R12  42,74.5 0 bottom
R13  42,72.5 0 bottom
R14  42,70.5 0 bottom
R15  45.5,75.5 270 bottom
R16  42,76.5 0 bottom
R17  42,68.5 0 bottom
R18  46.5,85.5 0 bottom
R19  46.5,87.5 180 bottom
RN1  58,36.5 90 top
S1  35,82.5 90 bottom
U1  14.48,18.07 270 top
U2  7,20 0 top
U3  10,25.5 270 top
U4  63,35.5 270 top
U5  61,20.5 0 top
U6  54.5,76.5 0 bottom
U$9  58.5,71 270 bottom
USB  35,0 0 bottom

### Tracks (layer width: path | path; a pad name or v marks a point on that pad's centre or on a via)
3.3V  (via drill 0.35)
  Top 0.2: v50.38,12.62 50.38,28.75 50,29 | v47.62,59 43.88,55.25 43.88,52.88 53.5,43.25 C5.1 | v41.88,64.75 41.88,66.62 v32,76.5
  Top 0.3: v32,76.5 31.5,76 31.5,65 | 31.5,65 31.5,64 30.5,63 DISP1.10 | DISP1.9 30.3,63.8 31.5,65
  Top 1: C5.1 53.65,42.15 FB1.1 53.65,32.65 50,29 v48,29
  Bottom 0.2: v50.38,12.62 47.62,9.88 47,9.88 J2.P$40 | v41.88,64.75 v47.62,59
  Bottom 0.3: R16.2 v32,76.5
  Bottom 0.5: J2.P$32 47.94,28.94 v48,29
5V  (via drill 0.35)
  Top 0.2: v42.88,12.62 42.88,16.62 48.88,22.62 48.88,24.25 40.25,32.88 43.12,35.75 43.12,42.25 43.5,42.62 43.5,55.88 54.25,66.62 54.5,67
  Top 1: v56,67 54.5,67 v51.5,70
  Bottom 0.2: J2.P$20 J2.P$19 40.75,11.25 41.88,12.38 42.62,12.38 v42.88,12.62
  Bottom 1: R10.2 v51.5,70 | v56,67 C12.1 56,68.71 U$9.2 60.79,68.71 5V.TP
ADC_0  (via drill 0.35)
  Top 0.2: U4.4 60.01,35 v59.88,35.13 | v44,67 44,80 46,82 v46,83
  Bottom 0.2: v59.88,35.13 59.88,37.86 61.75,39.73 61.75,49.25 v44,67 | 47,85.45 R18.1 46,84.05 v46,83
  Bottom 0.5: R18.1 R19.2
ADC_1  (via drill 0.35)
  Top 0.2: U4.5 v62.5,34.5 | v45,67.47 45,80.5 47.63,83.13 47.63,84.26 47.26,84.63 46.74,84.63 45.11,83 v44,83
  Bottom 0.2: v62.5,34.5 62.5,35.11 63.13,35.74 63.13,49.34 v45,67.47 | R3.1 44,85.45 v44,83
  Bottom 0.5: R4.2 R3.1
BACKLIGHT  (via drill 0.35)
  Top 0.2: v47.62,72 47.62,60.5 43.12,56 43.12,44.25 42,43.12 42,35.75 38.62,32.38 38.25,32.38 v36.25,30.38
  Bottom 0.2: v47.62,72 47.62,74.38 45.88,76.12 R15.1 | v36.25,30.38 40.12,26.5 40.75,26.5 J2.P$13
  Bottom 1: R16.1 42.95,76.45 R15.1
BAT+  (via drill 0.35 pad 1.5)
  Top 1.5: v8,14.5 8,21.5 8.69,22.19 9.18,22.19 10.58,23.59 U3.5
  Bottom 0.5: S1.1 39,82.5 40.55,84.05 R3.2
  Bottom 1: R7.2 7.5,9
  Bottom 1.5: C9.1 7.5,9 | 7.5,9 8,9.5 v8,14.5 3,19.5 3,75.5 15,75.5 24.5,85 36,85 37.54,83.46 S1.1 | BAT+.1 7.81,4.69 7.5,5 7.5,9
BAT-  (via drill 0.35, 0.35 pad 1)
  Top 0.2: U2.7 9.88,20 U2.6 | v16,8.62 17.88,10.5 17.88,18.62 18,19
  Top 0.5: 15.5,20 15.5,19.5 15.5,19.02 U1.6 15.78,20 15,20
  Top 1: 9.88,20 15,20 15.5,20 19,20 19,19 18,19
  Top 1.5: v18.5,19.5 15.5,19.5
  Bottom 0.2: v16,8.62 15.3,8.8
  Bottom 1: 14.3,4.71 BAT-.1
  Bottom 1.5: C8.2 15.3,8.8 14.3,7.8 14.3,4.71
D+
  Bottom 0.5: USB.3 35,8.5 34,9.5 D+.TP
D-
  Bottom 0.5: USB.2 35.65,8.65 36,9 D-.TP
DAC_LRCLK  (via drill 0.35)
  Top 0.2: v48.5,50.75 52.38,54.62 68,39 68,30.25 67.88,30.12 67.88,29.88 64.38,26.38 64.38,22.75 64,22.38 62,22.38 61.38,23 61.38,23.38 U5.15
  Bottom 0.2: v48.5,50.75 47.5,51.75 45.75,51.75 J2.P$23
DAC_SCLK  (via drill 0.35)
  Top 0.2: v62.62,24.5 U5.13
  Bottom 0.2: v62.62,24.5 60.75,22.62 43.75,22.62 42.5,21.38 40.75,21.38 J2.P$15
DAC_SDIN  (via drill 0.35)
  Top 0.2: v52.38,53.5 67.62,38.25 67.62,30.38 67.5,30.25 67.5,30 62.75,25.25 62.38,25.25 61.88,24.75 61.88,23.5 U5.14
  Bottom 0.2: v52.38,53.5 47.62,58.25 43.88,58.25 42.62,57 40.75,57 J2.P$1
DC_3V  (via drill 0.35)
  Top 0.2: v27.88,40.25 22.5,45.62 22.5,59 22.75,59.25 22.75,65.12 23.12,65.5 23.12,65.88 23.5,66.25 23.5,67.38 23.88,67.75 25.25,67.75 DISP1.4
  Bottom 0.2: v27.88,40.25 39.12,29 40.75,29 J2.P$12
GND  (via drill 0.35, 0.35 pad 1, 0.35 pad 1.5)
  Top 0.2: U2.3 4.12,20 U2.2 | I_LEFT.1 I_LEFT.2 I_CENTER.1 34.3,29 v34.5,29 | v36.63,28.87 37.79,27.71 I_CENTER.2 37.79,25.71 v38.5,25 | v39,20 37.79,18.79 I_DOWN.2 I_DOWN.1 | I_UP.1 I_UP.2 | v49.5,27.97 49.5,27 49.41,26.91 I_RIGHT.2 | U5.19 58.73,23.77 58,24.5 57,24.5 C1.1 57,27 57.38,27.38 RN1.8 | U5.11 63.92,24.57 v63.5,25 | U5.16 v60.67,25.5 v60.68,25.5 | DISP1.8 27.1,64.6 v27.5,65 | v27.5,69 27.5,70 27.3,70.2 DISP1.1
  Top 0.25: U5.9 63.5,17.58 U5.10 | U5.12 U5.11
  Top 0.3: U5.3 59.38,19.12 v59,19.5
  Top 1: 4.12,20 2.49,20 | 2.49,20 2.49,24 | 2.49,24 R6.1 | U3.3 5.87,24.86 5,24 2.49,24 | 2.49,20 v2.49,12.01 | v2.49,12.01 v2.5,12 | R5.1 2.53,12.05 v2.49,12.01 | v31,6 31,7.16 C10.2 | 56,19.5 C4.2 v53,19.5 v53,25.5 | 56,19.5 C16.1 | C5.2 C6.2 C7.2 v61,42 | v56.03,25.5 C1.1 | C2.2 56,19.5 | 63.5,17.58 65.5,17.58 C3.2
  Bottom 0.2: J2.P$11 42.52,31.48 43.5,30.5 v43.5,28 49.47,28 v49.5,27.97 50.53,27.97 v53,25.5 | v34.5,29 36.5,29 v36.63,28.87 | J2.P$36 45.04,19.49 44.36,19.49 43.86,20 v39,20 38.5,20.5 38.5,24 | v63.5,25 63,25.5 v60.68,25.5 v56.03,25.5 | v38.5,25 38.5,24 | 38.5,24 38.64,23.86 J2.P$14 | v27.5,65 v27.5,69
  Bottom 0.3: v59,19.5 v53,19.5
  Bottom 0.5: 54.51,74.5 U6.GND | 56,74 56,74.5 54.98,74.5 54.51,74.5 | 56,74 56,71.5 55.45,71.5 R11.1 | 54.51,74.5 54.51,74.01 | 54.51,74.01 55,74.01 | 54.51,74.01 54.6,73.92 54.6,70.9 54.75,70.75 | 55,74 56,74 | USB.5 33.7,5.8 33.5,6 v31,6
  Bottom 1: v2.5,12 C9.2 | 55,74.01 55,74 | v56.03,25.5 v53,25.5 53,34 v61,42 | GND.TP 55,71 54.75,70.75
  Bottom 1.5: 49,70.5 50.93,68.57 C12.2 54,70 54.75,70.75 55.45,71.45 R11.1 | 49,70.5 Q1.2 | C11.2 49,77 49,70.5
  pour Bottom: 0,90 70,90 70,0 -0.5,0 -0.5,1.5 -0.5,90
  pour Top: 0,-1.5 0,87 arc-90 3,90 67,90 arc-90 70,87 70,-1.5
GPIO_6  (via drill 0.35)
  Top 0.2: v13.38,85.75 23.88,85.75 43.88,65.75 36.25,58.12 36.25,48.88 v35.88,48.5
  Bottom 0.2: v13.38,85.75 12.38,85.75 I_SLEEP.2 | v35.88,48.5 38.88,45.5 42.88,45.5 44,46.62 45.75,46.62 J2.P$25
GPIO_CENTER  (via drill 0.35)
  Top 0.2: I_CENTER.3 32.25,23.12 37.75,23.12 I_CENTER.4 37.88,23.12 41,26.25 43.12,26.25 43.25,26.38 v43.5,26.38
  Bottom 0.2: v43.5,26.38 45.75,26.38 J2.P$33
GPIO_DOWN  (via drill 0.35)
  Top 0.2: I_DOWN.3 32.25,13.12 37.75,13.12 I_DOWN.4 37.88,13.12 44.62,19.88 v44.62,20.12
  Bottom 0.2: v44.62,20.12 45.75,21.25 J2.P$35
GPIO_LEFT  (via drill 0.35)
  Top 0.2: I_LEFT.3 22.25,23.12 27.75,23.12 I_LEFT.4 27.88,23.12 31,26.25 33.12,26.25 42.75,35.88 v42.75,42.88
  Bottom 0.2: v42.75,42.88 43.62,43.75 45.38,43.75 45.75,44.12 J2.P$26
GPIO_RIGHT  (via drill 0.35)
  Top 0.2: 43.5,23.12 47.75,23.12 I_RIGHT.4 | 43.5,23.12 42.25,23.12 I_RIGHT.3 | 43.5,23.12 v43.5,23.62
  Bottom 0.2: v43.5,23.62 45.62,23.62 45.75,23.75 J2.P$34
GPIO_UP  (via drill 0.35)
  Top 0.2: I_UP.3 32.25,33.12 37.75,33.12 I_UP.4 37.88,33.12 39.62,34.88 v39.62,53.12
  Bottom 0.2: v39.62,53.12 40.75,54.25 J2.P$2
GPIO_VOL_DOWN  (via drill 0.35)
  Top 0.2: v64.62,66.62 63.38,66.62 v47.25,50.5
  Bottom 0.2: v47.25,50.5 46.12,49.38 45.75,49.38 J2.P$24 | 65.75,67.62 I_VOL_DOWN.2 64.79,66.62 v64.62,66.62
GPIO_VOL_UP  (via drill 0.35)
  Top 0.2: v65.75,76.62 65.75,75.62 58.56,68.44 v45.62,55.5
  Bottom 0.2: v65.75,76.62 65.75,77.62 I_VOL_UP.2 | v45.62,55.5 45.62,54.38 45.75,54.38 J2.P$22
LCDCS_3V  (via drill 0.35)
  Top 0.2: DISP1.5 26.75,67 v29.25,64.5
  Bottom 0.2: v29.25,64.5 29.25,46.25 38.88,36.62 40.75,36.62 J2.P$9
LEDK
  Bottom 1: R12.1 R13.1 R14.1 R17.1 Q1.3
MISO  (via drill 0.35)
  Top 0.2: v28.62,45.88 23.25,51.25 23.25,58.75 23.5,59 23.5,64.88 24,65.38 25.25,65.38 DISP1.7
  Bottom 0.2: v28.62,45.88 38.88,35.62 42.75,35.62 44.25,34.12 45.75,34.12 J2.P$30
MOSI_3V  (via drill 0.35)
  Top 0.2: v30.5,43 22.88,50.62 22.88,58.88 23.12,59.12 23.12,65 23.5,65.38 23.5,65.75 23.88,66.12 25.25,66.12 DISP1.6
  Bottom 0.2: v30.5,43 38.25,35.25 42.62,35.25 43.5,34.38 43.5,31.5 45.75,31.5 J2.P$31
N$1
  Top 0.3: U5.18 59.38,25.12 C1.2
N$2
  Top 0.3: C2.1 58.9,14.4 60.27,14.4 60.67,14.8 U5.5
N$3
  Top 0.2: A2.TP 66.5,34.5 66,35 U4.7
N$4
  Top 0.3: U5.4 60.02,15.53 60,15.5 C15.2
N$5
  Top 0.25: R2.1 63,14 61.98,15.03 U5.7
N$6
  Top 0.25: U5.6 61.33,14.32 61,14 R1.1
N$7
  Top 0.3: C15.1 58.73,16.73 U5.2
N$8  (via drill 0.35)
  Top 0.2: v7.12,22.5 5.62,21 4.12,21 U2.1 | v10.62,21.75 9.88,21 U2.8
  Bottom 0.2: v7.12,22.5 7.88,21.75 v10.62,21.75
N$9  (via drill 0.35)
  Top 1: 63,10 R2.2 63.05,10.5 65,10.5 | 63,10 C13.2 63.5,9 64.5,10 | v65,12.5 65,10.5 | 65,10.5 64.5,10 | 64.5,10 63,10 | v26.5,11.5 59.5,11.5 v59.5,12.5
  Bottom 1: J1.TIP 26.5,10.45 v26.5,11.5 | v59.5,12.5 v65,12.5
N$10  (via drill 0.35)
  Top 0.5: 60.95,10.5 R1.2
  Top 1: R1.2 C14.2 | v26.5,8.5 28.35,10.35 60.8,10.35 60.95,10.5
  Bottom 1: J1.RING1 26.25,8.25 v26.5,8.5
N$11
  Top 0.2: U1.1
  Top 0.5: U2.5 U1.1
N$12
  Top 1: R5.2 11.5,18.07 U1.2
N$13
  Top 1: R6.2 6.9,26.11 U3.2
N$14  (via drill 0.35 pad 0.2)
  Top 0.5: U2.4 6,19.02 v6,19 | v13,16 13.18,16.18 U1.3
  Bottom 0.5: v6,19 6.5,19 9.5,16 v13,16
N$15  (via drill 0.35)
  Top 0.2: v52,84.12 52,77.88 46.5,72.38 46.5,67.75 36.62,57.88 36.62,48 v17,28.38 | v14.62,25.5 13.75,25.5 13.12,24.88 U3.6
  Bottom 0.2: v52,84.12 52,85.5 R9.1 | v17,28.38 14.62,26 v14.62,25.5
N$16  (via drill 0.35 pad 1)
  Top 1: U1.5 16.97,18.07 v17,18.1
  Bottom 1: v17,18.1 16.9,18 14.5,18 14.5,15 15.3,14.2 C8.1 13.5,13 13,12.5 13,9.5 12.5,9 R7.1
N$17  (via drill 0.35)
  Top 0.25: D2.C 57,87.55 v57,88.5
  Bottom 0.25: v57,88.5 57,85.55 R8.2
N$18  (via drill 0.35)
  Top 0.25: D1.C 54,87.55 v54,88.5
  Bottom 0.25: v54,88.5 54,85.55 R9.2
N$19  (via drill 0.35)
  Top 0.2: v58.88,84.12 58.75,84.12 46.88,72.25 46.88,67.62 37,57.75 37,47 v17.75,27.75 | v16.25,26.25 13.12,26.25 U3.7
  Bottom 0.2: v58.88,84.12 58.88,85.5 R8.1 | v16.25,26.25 v17.75,27.75
N$20
  Bottom 0.152: 55.5,75.4 U6.SW
  Bottom 1: U$9.1 L1.1 | 58.5,75.35 L1.1 | L1.1 55.5,75.4
N$21  (via drill 0.35)
  Top 0.3: v33,74.5 32.5,74 32.5,62.5 32.2,62.2 DISP1.11
  Bottom 0.3: R12.2 v33,74.5
N$22  (via drill 0.35)
  Top 0.3: DISP1.12 32.4,61.4 33,62 33,71.5 34,72.5 v34.5,72.5
  Bottom 0.3: R13.2 v34.5,72.5
N$23  (via drill 0.35)
  Top 0.3: DISP1.13 32.6,60.6 33.5,61.5 33.5,69.5 v34.5,70.5
  Bottom 0.3: R14.2 v34.5,70.5
N$24
  Bottom 1: R10.1 51.5,73 | 51.5,73 52.5,73 | 52.5,73 53,73 | 53,73 R11.2 53.55,74.63 U6.FB | U6.FB 53,75.35 | 53,75.35 53,73 | 53,75.35 52.5,75.35 | 52.5,75.35 52.5,73 | 52.5,75.35 51.5,75.35 51.5,73
N$25
  Bottom 1: Q1.1 45.55,74.55 R15.2
N$26  (via drill 0.35)
  Top 0.3: DISP1.14 32.8,59.8 34,61 34,68 v34.5,68.5
  Bottom 0.3: R17.2 v34.5,68.5
N$27  (via drill 0.35)
  Top 0.2: U4.1 62,36.5 v62.5,36 | v59,34.5 59,34.92 RN1.1
  Bottom 0.2: v62.5,36 61,34.5 | 61,34.5 v59,34.5 | 61,34.5
N$31
  Top 0.2: RN1.2 59.4,36.1 59.5,36 U4.2
N$32
  Top 0.2: U4.6 65.11,31.89 A3.TP
N$33
  Bottom 1: 58.5,79.5 58,79.5 | 58,79.5 57.5,79.5 | 57.5,79.5 57,79.5 | 57,79.5 55,79.5 54.5,79.5 | 54.5,79.5 C11.1 53.5,77.65 U6.EN U6.IN 54.5,79 | 54.5,79 54.5,79.5 | 59.5,77.5 59.5,79.5 | 59.5,79.5 58.5,79.5 | L1.2 58.5,79.5 | L1.2 58,77.6 58,79.5 | L1.2 57.5,77.6 57.5,79.5 | L1.2 57,77.6 57,79 | 57,79.5 57,79 | 57,79 54.5,79 | 53.75,80.75 54,80.5 IN.TP 60.5,80.5 59.5,79.5
  Bottom 2: S1.2 35,79.5 44,79.5 45.5,79.5 48.5,82.5 52,82.5 53.75,80.75 55,79.5
RESET_3V  (via drill 0.35)
  Top 0.2: v26.88,40.25 22.12,45 22.12,59.12 22.38,59.38 22.38,65.25 22.75,65.62 22.75,66 23.12,66.38 23.12,67.5 23.5,67.88 23.5,68.88 24,69.38 25.25,69.38 DISP1.2
  Bottom 0.2: v26.88,40.25 27.62,41 32,41 38.88,34.12 40.75,34.12 J2.P$10
SCL  (via drill 0.35)
  Top 0.2: RN1.4 59.5,37.7 | U4.10 63.5,36.5 62.3,37.7 60.5,37.7 59.5,37.7 | 59.5,37.7 v59.5,38.37 | v55.53,27 55.53,26.06 55.28,25.81 55.28,25.19 55.53,24.94 v55.53,24 | v49.51,24 v49.5,24 v49.5,14
  Bottom 0.2: v59.5,38.37 59.5,35.89 58.37,34.76 58.37,29.84 v55.53,27 | v55.53,24 v49.51,24 | v49.5,14 49.5,13.7 J2.P$38
SCLK_3V  (via drill 0.35)
  Top 0.2: v30.38,64.88 26.75,68.5 25.38,68.5 DISP1.3 | v37.75,57.5 42.75,52.5 42.75,44.38 41.62,43.25 41.62,38.25 v41.25,37.88
  Bottom 0.2: v37.75,57.5 v30.38,64.88 | v41.25,37.88 42.75,37.88 44,36.62 45.75,36.62 J2.P$29
SDA  (via drill 0.35)
  Top 0.2: RN1.3 62.6,36.9 63.5,36 | 63.5,36 U4.9 | v48.5,12.53 48.5,21.13 v48.87,21.5 | v63.5,33 63.5,36
  Bottom 0.2: J2.P$39 47.13,11.16 v48.5,12.53 | v48.87,21.5 61,21.5 64.5,25 64.5,32 v63.5,33
V_USB  (via drill 0.35, 0.35 pad 1, 0.35 pad 1.5)
  Top 0.2: 51,86.5 36.46,86.5 S1.3
  Top 0.25: D2.A 58.05,86.5 51,86.5 51,86.55 D1.A
  Top 0.5: v45,82 43.5,80.5 v32.5,80.5
  Top 1: U3.4 8.6,23.59 10,25 10,26 10.75,26.75 | 10.75,26.75 11.4,27.41 U3.8 16.59,27.41 17.5,26.5 17.5,21.5 17.85,21.15 19.48,21.15 27.98,12.65 v29.5,12.65 | v39,6 39,7.16 C10.1 36.5,9 31.2,9 v31,9.2 | 10.5,27 10.75,27 10.75,26.75
  Top 1.5: v5.5,32 10.5,27
  Bottom 0.5: USB.1 36.3,5.8 36.5,6 v39,6 | R18.2 45,85.45 v45,82 | v32.5,80.5 32.5,82.46 S1.3
  Bottom 1: v29.5,12.65 29.5,10.7 v31,9.2
  Bottom 1.5: S1.3 25.5,82.5 16,73 5.5,73 v5.5,32
VCC-ISO
  Top 0.2: 55.5,36.5 55.5,37 | 55.5,35.5 55.5,36 | U4.8 66,35.5 66,37 63.5,37 61.5,39 57.38,39 | 57.38,39 55.5,39 | RN1.7 RN1.6 RN1.5 57.38,39
  Top 0.3: U5.20 58.08,21.93 58.5,21.5 58.08,21.07 U5.1 | U5.17 60.02,21.52 60,21.5 | U5.8 62.62,21.38 62.5,21.5
  Top 0.75: 55.6,36.1 55.5,36 | 55.6,36.9 55.5,37
  Top 1: C3.1 62.5,21.5 60,21.5 58.5,21.5 C16.2 C4.1 54.5,31.5 55.5,32.5 55.5,36 55.5,37 55.5,39 55.5,39.85 FB1.2 C6.1 C7.1

### Text on the board
tNames: PiPod | By Bram Rausch
bNames: SS34